# EAGLE board GPS Tracker v1.2 (EAGLE 6.4)
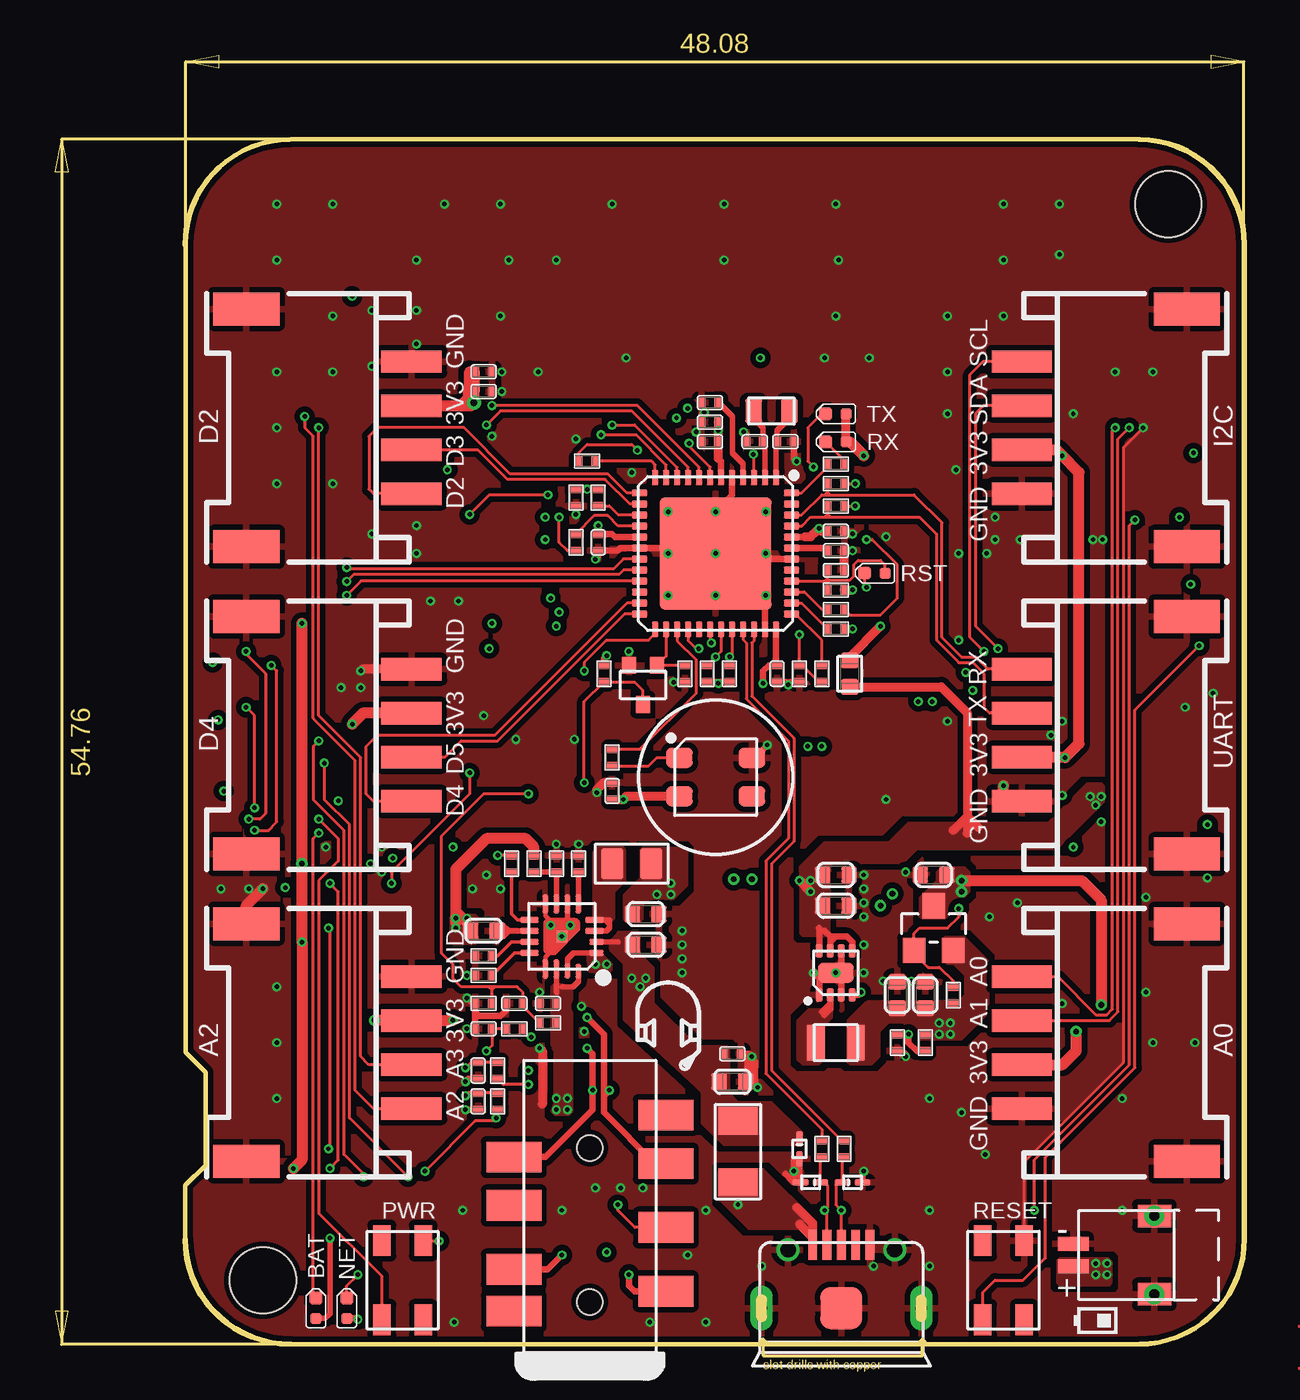
[diagram p2: board, top side]
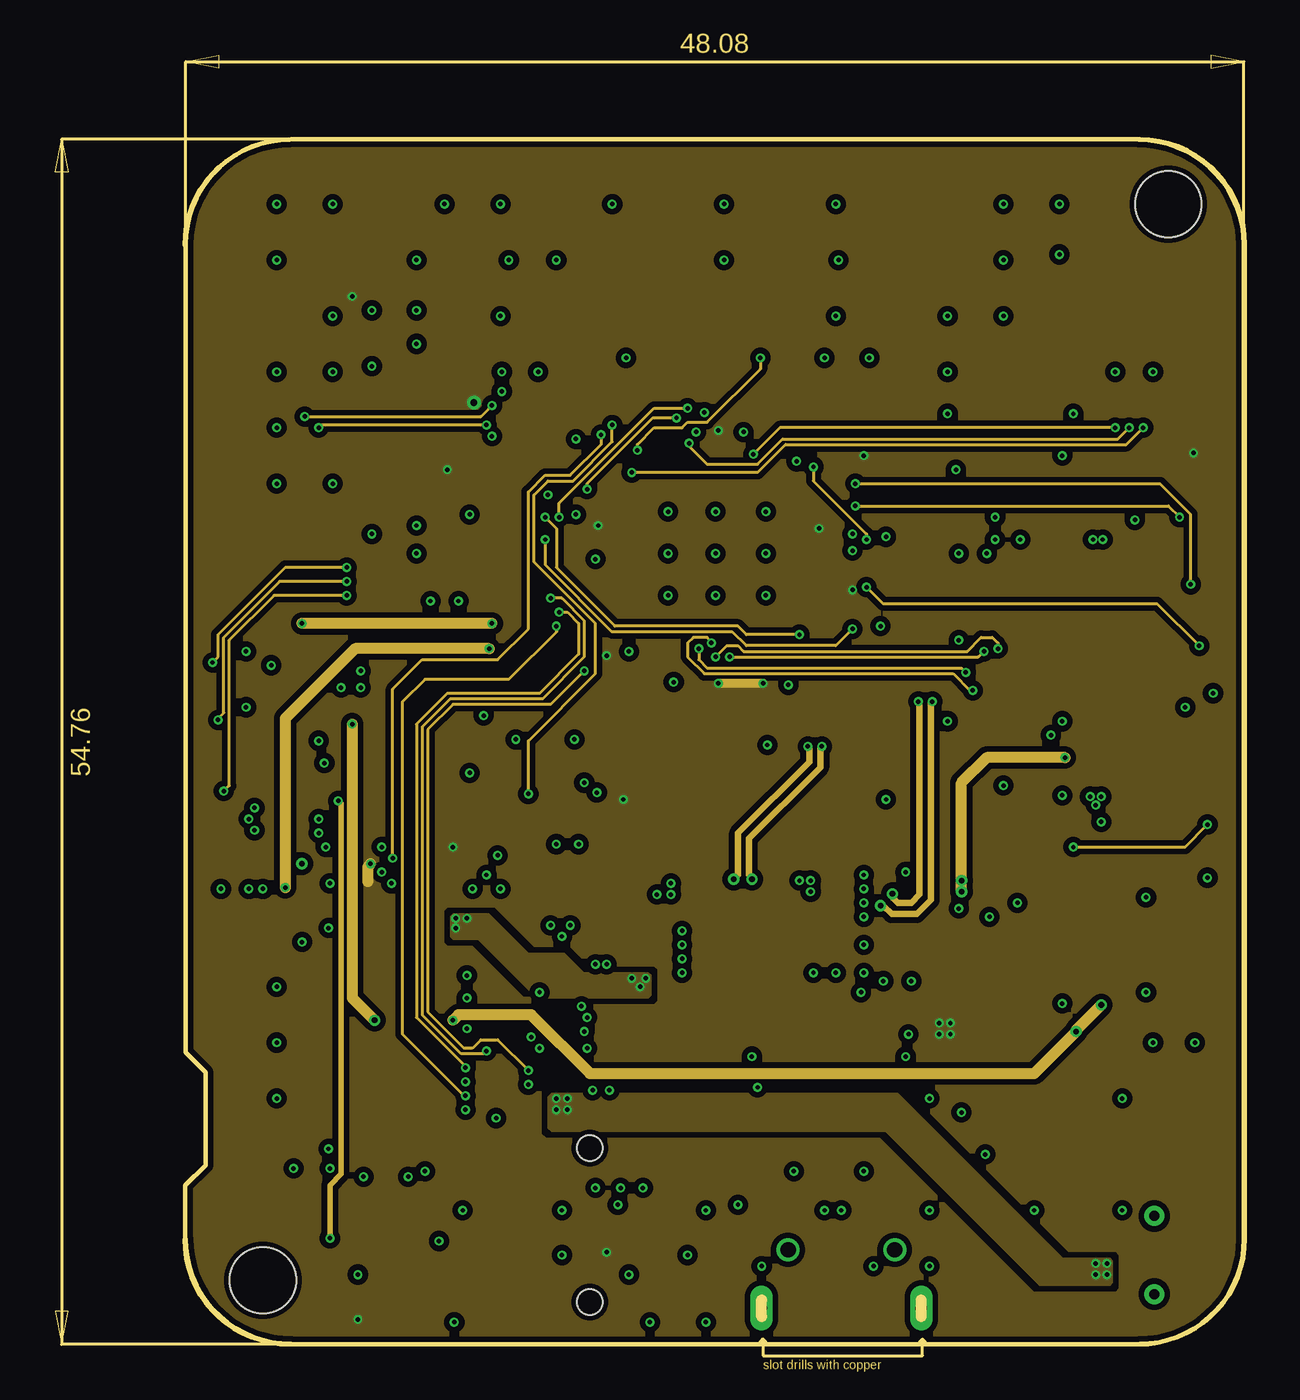
[diagram p3: board, inner layer PWR]
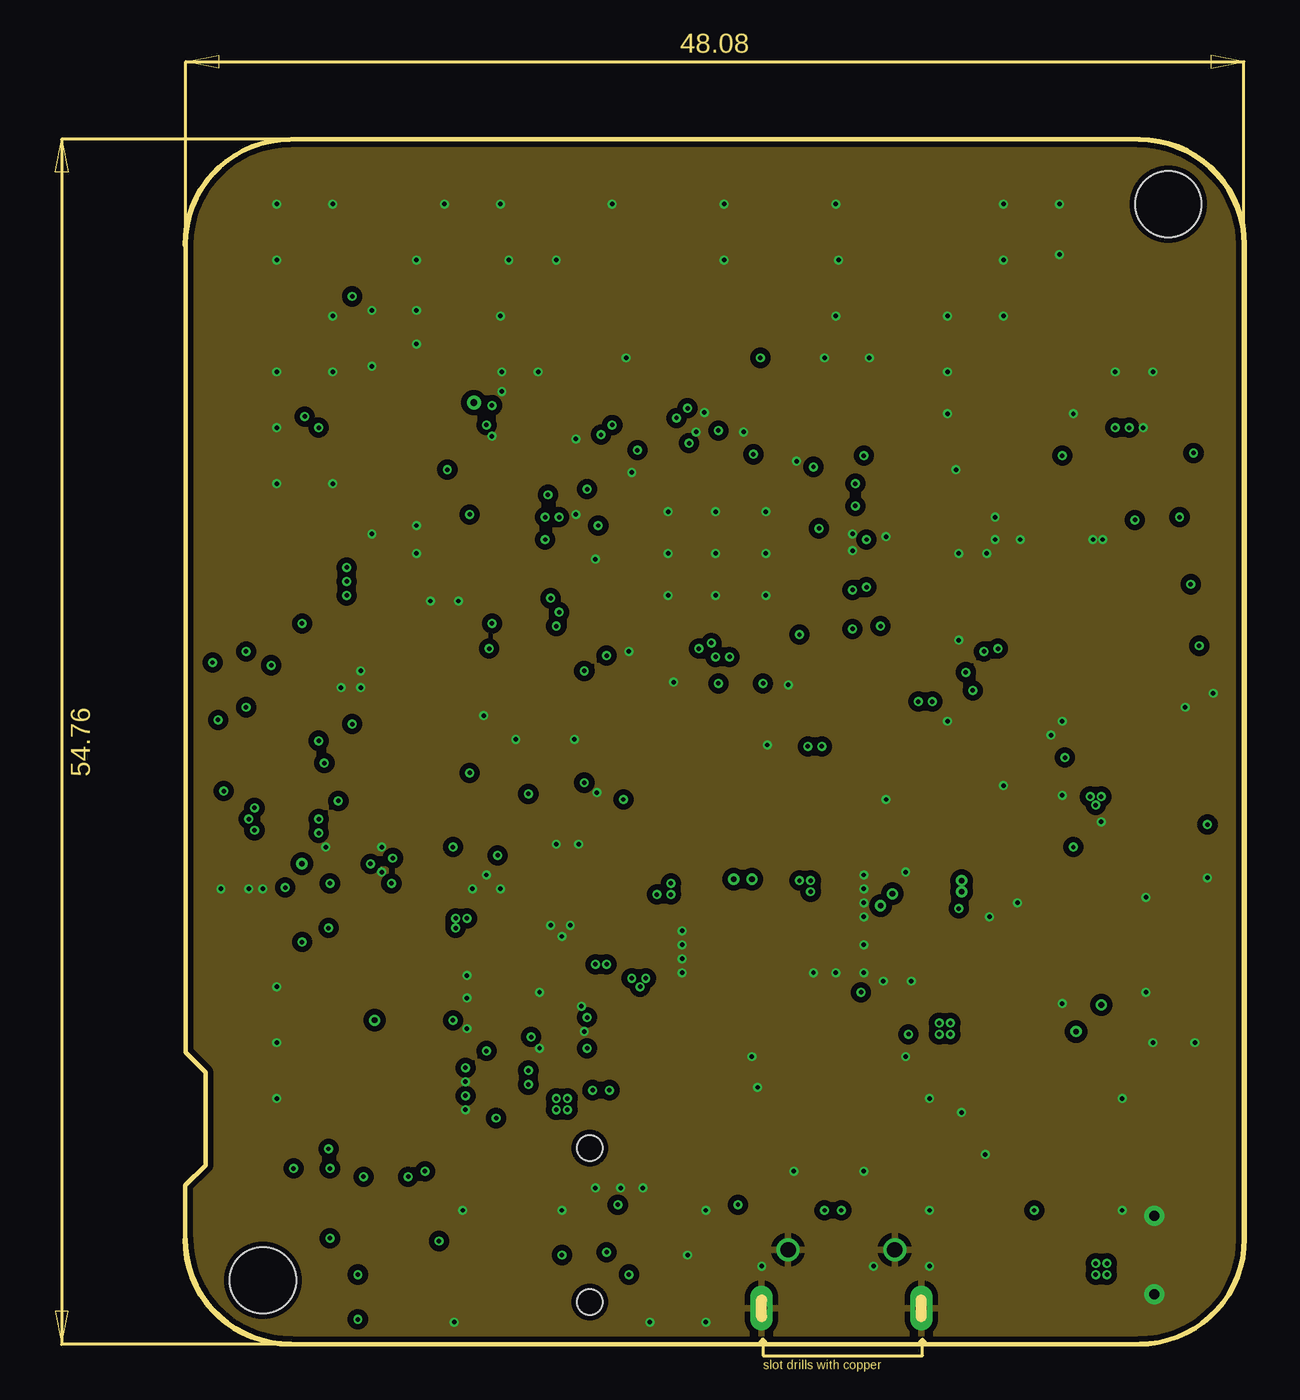
[diagram p4: board, inner layer GND]
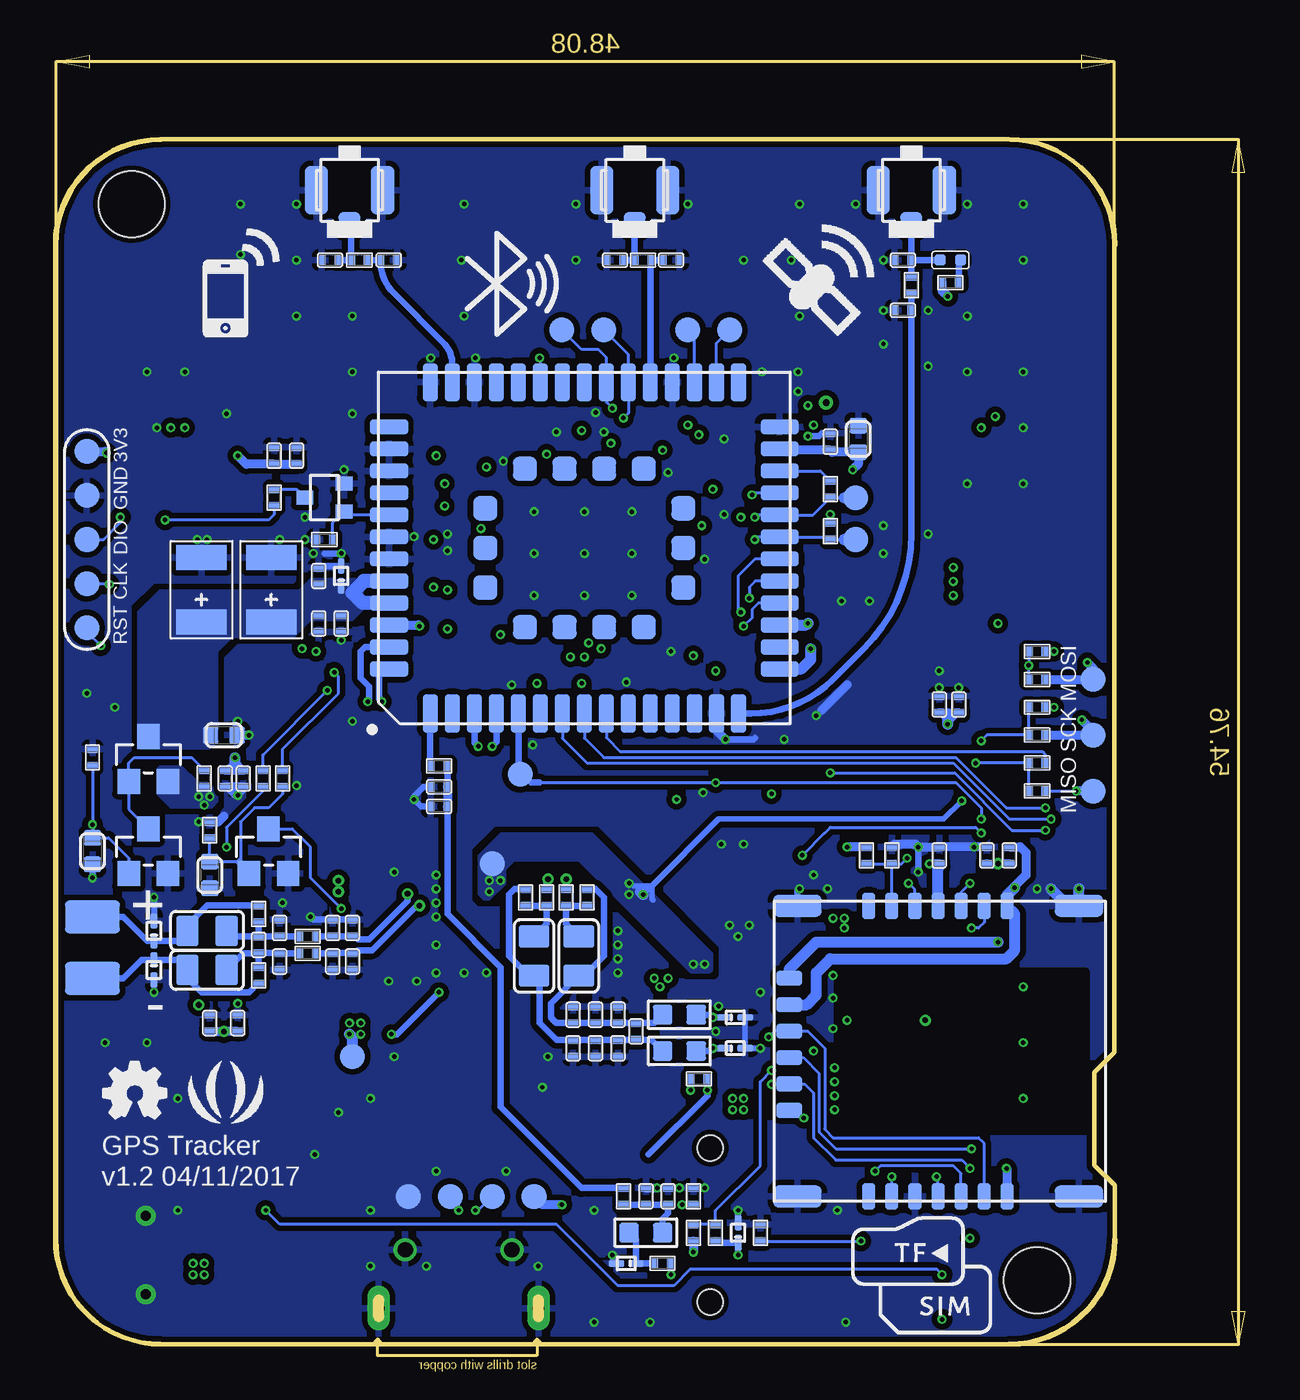
[diagram p5: board, bottom side, seen from below]

Size 48.18 x 54.76 mm. Coordinates in mm from the lower left corner, seen from the top.
Outline: 0.05,49.98 arc-90 4.83,54.76 43.4,54.76 arc-90 48.18,49.98 48.18,4.8 arc-90 43.4,0.03
Outline: 0.05,4.8 arc90 4.83,0.03
Outline: 4.83,0 43.43,0
Outline: 0,4.78 arc90 4.78,0 43.35,0 arc90 48.13,4.78 48.13,49.96 arc90 43.35,54.74
Outline: 4.78,54.74 arc90 0,49.96
Outline: 48.16,49.91 48.16,4.73
Outline: 0.05,50.11 0.05,13.31
Outline: 0.05,13.42 0.05,13.27 0.95,12.37 0.95,8.15 0.03,7.23 0.03,4.62
Copper layers (1*2*15*16): Top 0.035mm / dielectric 0.2mm / PWR 0.0175mm / dielectric 0.3mm / GND 0.0175mm / dielectric 0.2mm / Bottom 0.035mm
Design rules "SeeedStudio_4layer_DRU_no_angle_20140221 *": minimum track width 1mil, minimum drill 8mil, track to track 5mil, track to pad 5mil, pad to pad 5mil, via to via 5mil, smd to smd 0mil, copper to edge 10mil, drill to drill 8mil, minimum pad ring 4mil, minimum via ring 4mil, stop-mask expansion 4mil, vias tented up to drill 25mil, thermal gap 10mil
Holes 3 mm at 3.56,2.92 44.7,51.82
tRestrict: area 29.3,12.8 to 29.8,14.4

## Footprints (pad centres in the part's own frame; a part is rotated, then mirrored left to right if it is on the bottom)
HW4-SMD-2.0-90D = smd 1.01 x 2.74: 1 -3,-0.1; 2 -1,-0.1; 3 1,-0.1; 4 3,-0.1 | smd 1.5 x 3: SS1 -5.4,7.4; SS2 5.4,7.4
U-FL3P-SMD-2.6X2.6X1.0MM = smd 1.05 x 1: D -1.524,0 | smd 2.2 x 1.05: GND1 0,1.5; GND2 0,-1.5
C0402 = smd 0.508 x 0.385: 1 0,0.383; 2 0,-0.383
AVX-B = smd 1.143 x 2.286: + -1.46,0; - 1.46,0
C0603 = smd 0.762 x 0.696: 1 0,0.602; 2 0,-0.602
C0805 = smd 1.397 x 1.016: 1 0,0.889; 2 0,-0.889
SOD-923 = smd 0.7 x 0.3: 1 -0.45,0; 2 0.45,0
LED-0402 = smd 0.5 x 0.5: + -0.463,0 | smd 0.58 x 0.58: - 0.468,0
F1206 = smd 1.27 x 1.778: 1 -1.397,0; 2 1.397,0
8P-3.5-SMD = smd 1.4 x 2.5: 1 2.8,-3.45; 2 5.7,-3.45; 3 8.6,-3.45; 4 8.9,3.45; 5 1.9,3.45; 6 3.8,3.45; 7 6.7,3.45; 8 10.8,-3.45 | hole 1.149: 2.3,0; 9.3,0
HW2-SMD-1.0-90D = smd 1.524 x 1.016: 3 -3.429,1.778; 4 -3.429,-1.778 | smd 1.397 x 0.635: + 0.254,0.508; - 0.254,-0.508
MICRO-USB5+5P-SMD-0.65-7.2X5.06MM = smd 0.4 x 1.35: 1 -1.3,2.875; 2 -0.65,2.875; 3 0,2.875; 4 0.65,2.875; 5 1.3,2.875 | smd 1.9 x 1.9: P1 0,0 | drill 0.508 pad 1.016 long: P3 -3.625,0; P4 3.625,0 | drill 0.7: P5 -2.425,2.65; P6 2.425,2.65
H5-SMD-2.0-TEST = smd 1.143 x 1.143: 1 0,4; 2 0,2; 3 0,0; 4 0,-2; 5 0,-4
SIM+TF-24P-SMD-1.2-15.05X13.66X2.5MM = smd 1.2 x 0.6: P1 0,3.26; P2 0,4.31; P3 0,5.36; P5 13.2,3.26; P6 13.2,4.31; P7 13.2,5.36; T1 13.2,9.56; T2 13.2,8.51; T3 13.2,7.46; T4 13.2,6.41; T5 0,6.41; T6 0,7.46; T7 0,8.51; T8 0,9.56 | smd 0.7 x 1.2: P1B 9.91,13.17; P2B 7.51,13.17; P3B 3.91,13.17; P5B 8.71,13.17; P6B 6.31,13.17; P7B 5.11,13.17 | smd 1 x 2.2: PAD 0,0; PAD1 0,12.8; PAD2 13.2,0; PAD3 13.2,12.8
SW4P-SMD-4.5X3.2X2.5MM = smd 1.4 x 0.8: 1 -1.8,-0.94; 2 1.8,-0.94; 3 1.8,0.94; 4 -1.8,0.94
L0402 = smd 0.5 x 0.5: 1 -0.463,0; 2 0.463,0
L201610 = smd 0.8 x 1.6: 1 -0.9,0; 2 0.9,0
L0805 = smd 1.016 x 1.397: 1 -0.889,0; 2 0.889,0
L0603 = smd 0.889 x 0.889: 1 -0.762,0; 2 0.762,0
LED4-1.75-3.7X3.5X0.95MM = smd 1.2 x 0.9: 1 -1.65,0.875; 2 -1.65,-0.875; 3 1.65,-0.875; 4 1.65,0.875
SOT-323 = smd 0.635 x 0.762: 1 -0.635,-0.889; 2 0.635,-0.889; 3 0,0.889
SOT-23 = smd 1.016 x 1.143: 1 -0.889,-1.016; 2 0.889,-1.016; 3 0,1.016
R0402 = smd 0.508 x 0.385: 1 0,0.383; 2 0,-0.383
R0603 = smd 0.762 x 0.696: 1 0,0.602; 2 0,-0.602
2P-SMD-SPEAKER = smd 2.5 x 1.5: 1 0,1.397; 2 0,-1.397
TP-D45MIL = smd 1.143 x 1.143: T 0,0
MODULE68P-SMD-1.0-18.7X16X2.1MM = smd 1.75 x 0.7: 1 -7.525,7; 2 -7.525,6; 3 -7.525,5; 4 -7.525,4; 5 -7.525,3; 6 -7.525,2; 7 -7.525,1; 8 -7.525,0; 9 -7.525,-1; 10 -7.525,-2; 11 -7.525,-3; 12 -7.525,-4; 13 -7.525,-5; 14 -7.525,-6; 15 -7.525,-7; 28 7.525,-7; 29 7.525,-6; 30 7.525,-5; 31 7.525,-4; 32 7.525,-3; 33 7.525,-2; 34 7.525,-1; 35 7.525,0; 36 7.525,1; 37 7.525,2; 38 7.525,3; 39 7.525,4; 40 7.525,5; 41 7.525,6; 42 7.525,7 | smd 0.7 x 1.75: 16 -5.5,-8.875; 17 -4.5,-8.875; 18 -3.5,-8.875; 19 -2.5,-8.875; 20 -1.5,-8.875; 21 -0.5,-8.875; 22 0.5,-8.875; 23 1.5,-8.875; 24 2.5,-8.875; 25 3.5,-8.875; 26 4.5,-8.875; 27 5.5,-8.875; 43 5.5,8.875; 44 4.5,8.875; 45 3.5,8.875; 46 2.5,8.875; 47 1.5,8.875; 48 0.5,8.875; 49 -0.5,8.875; 50 -1.5,8.875; 51 -2.5,8.875; 52 -3.5,8.875; 53 -4.5,8.875; 54 -5.5,8.875 | smd 1.1 x 1.1: 55 -3.6,2.7; 56 -3.6,0.9; 57 -3.6,-0.9; 58 -3.6,-2.7; 59 -1.8,-4.5; 60 0,-4.5; 61 1.8,-4.5; 62 3.6,-2.7; 63 3.6,-0.9; 64 3.6,0.9; 65 3.6,2.7; 66 1.8,4.5; 67 0,4.5; 68 -1.8,4.5
DFN8G-0.5-2X2MM = smd 0.6 x 0.3: 1 -1,0.75; 2 -1,0.25; 3 -1,-0.25; 4 -1,-0.75; 5 1,-0.75; 6 1,-0.25; 7 1,0.25; 8 1,0.75 | smd 0.9 x 1.6: 9 0,0
QFN48-7X7 = smd 0.7 x 0.3: 1 -3.45,2.75; 2 -3.45,2.25; 3 -3.45,1.75; 4 -3.45,1.25; 5 -3.45,0.75; 6 -3.45,0.25; 7 -3.45,-0.25; 8 -3.45,-0.75; 9 -3.45,-1.25; 10 -3.45,-1.75; 11 -3.45,-2.25; 12 -3.45,-2.75; 25 3.45,-2.75; 26 3.45,-2.25; 27 3.45,-1.75; 28 3.45,-1.25; 29 3.45,-0.75; 30 3.45,-0.25; 31 3.45,0.25; 32 3.45,0.75; 33 3.45,1.25; 34 3.45,1.75; 35 3.45,2.25; 36 3.45,2.75 | smd 0.3 x 0.7: 13 -2.75,-3.45; 14 -2.25,-3.45; 15 -1.75,-3.45; 16 -1.25,-3.45; 17 -0.75,-3.45; 18 -0.25,-3.45; 19 0.25,-3.45; 20 0.75,-3.45; 21 1.25,-3.45; 22 1.75,-3.45; 23 2.25,-3.45; 24 2.75,-3.45; 37 2.75,3.45; 38 2.25,3.45; 39 1.75,3.45; 40 1.25,3.45; 41 0.75,3.45; 42 0.25,3.45; 43 -0.25,3.45; 44 -0.75,3.45; 45 -1.25,3.45; 46 -1.75,3.45; 47 -2.25,3.45; 48 -2.75,3.45 | smd 5.1 x 5.1: PAD 0,0
QFN16G-0.5-3X3MM@1 = smd 0.65 x 0.28: 1 -1.575,0.75; 2 -1.575,0.25 | smd 0.85 x 0.28: 3 -1.475,-0.25; 4 -1.475,-0.75; 9 1.475,-0.75; 10 1.475,-0.25; 11 1.475,0.25; 12 1.475,0.75 | smd 0.28 x 0.85: 5 -0.75,-1.475; 6 -0.25,-1.475; 7 0.25,-1.475; 8 0.75,-1.475; 13 0.75,1.475; 14 0.25,1.475 | smd 0.28 x 0.65: 15 -0.25,1.575; 16 -0.75,1.575 | smd 0.508 x 0.508: PAD 0,0
X2-SMD-L2.0X1.2X0.55MM = smd 0.762 x 1.143: 1 -0.813,0; 2 0.813,0

## Placement (x,y rotation side)
A0  [HW4-SMD-2.0-90D]  38.15,13.72 270 top
A2  [HW4-SMD-2.0-90D]  10.21,13.72 90 top
ANT1  IPEX  [U-FL3P-SMD-2.6X2.6X1.0MM]  34.8,52.45 90 bottom
ANT2  IPEX  [U-FL3P-SMD-2.6X2.6X1.0MM]  21.84,52.45 90 bottom
ANT4  IPEX  [U-FL3P-SMD-2.6X2.6X1.0MM]  9.27,52.45 90 bottom
C1  100nF  [C0402]  29.59,35.18 90 top
C2  100nF  [C0402]  29.59,36.07 90 top
C3  220uF  [AVX-B]  38.35,34.29 90 bottom
C4  10uF  [C0603]  40.51,27.69 90 bottom
C5  33pF  [C0402]  13.33,11.05 180 top
C6  33pF  [C0402]  13.33,12.45 180 top
C7  100nF  [C0402]  26.92,30.48 0 top
C8  100nF  [C0402]  18.8,36.45 180 top
C9  DNP  [C0402]  20.19,49.28 270 bottom
C10  10uF  [C0603]  33.65,15.88 0 top
C11  100nF  [C0402]  4.83,22.22 0 bottom
C12  100nF  [C0402]  8,22.22 180 bottom
C13  33pF  [C0402]  13.59,14.35 90 top
C14  100nF  [C0603]  46.48,22.42 0 bottom
C15  10uF  [C0603]  29.59,19.94 270 top
C16  10uF  [C0603]  32.38,15.88 0 top
C17  10uF  [C0603]  24.89,11.94 90 top
C18  1uF  [C0402]  23.88,41.91 90 top
C19  100nF  [C0402]  23.88,42.8 90 top
C20  100nF  [C0402]  29.59,36.96 90 top
C21  100nF  [C0402]  23.88,41.02 90 top
C22  10uF  [C0603]  20.95,18.16 90 top
C23  10uF  [C0603]  13.59,18.8 90 top
C24  10uF  [C0603]  20.95,19.56 90 top
C25  1uF  [C0402]  16.51,15.49 270 top
C26  100nF  [C0402]  24.89,13.21 90 top
C27  DNP  [C0402]  9.65,49.28 90 bottom
C28  10uF  [C0603]  29.59,21.34 270 top
C29  10uF  [C0603]  34.04,21.34 270 top
C30  100nF  [C0402]  39.88,14.61 0 bottom
C31  1uF  [C0402]  41.15,14.61 0 bottom
C32  100nF  [C0402]  7.11,29.08 0 bottom
C33  DNP  [C0402]  9.65,46.99 90 bottom
C34  DNP  [C0402]  22.73,49.28 90 bottom
C35  DNP  [C0402]  33.02,49.28 270 bottom
C36  DNP  [C0402]  35.69,49.28 90 bottom
C37  DNP  [C0402]  21.78,14.22 180 bottom
C38  1uF  [C0402]  13.59,44.2 270 top
C39  100nF  [C0402]  13.59,43.31 270 top
C40  220uF  [AVX-B]  41.53,34.29 90 bottom
C45  22pF  [C0402]  25.91,41.02 90 top
C46  22pF  [C0402]  27.3,41.02 270 top
C48  100pF  [C0402]  38.93,18.16 180 bottom
C49  33pF  [C0402]  34.67,17.4 180 bottom
C50  33pF  [C0402]  34.67,18.92 0 bottom
C51  33pF  [C0402]  37.97,17.4 180 bottom
C52  33pF  [C0402]  37.97,18.92 0 bottom
C53  22uF  [C0805]  41.27,17.02 270 bottom
C54  22uF  [C0805]  41.27,18.8 270 bottom
C56  10pF  [C0402]  35.56,18.92 0 bottom
C57  10pF  [C0402]  35.56,17.4 180 bottom
C58  33pF  [C0402]  24.64,14.99 0 bottom
C59  10pF  [C0402]  23.62,13.46 0 bottom
C60  33pF  [C0402]  24.64,13.46 180 bottom
C61  10pF  [C0402]  23.62,14.99 0 bottom
C62  33pF  [C0402]  30.73,24.45 90 bottom
C64  22uF  [C0805]  26.42,17.65 0 bottom
C65  22uF  [C0805]  24.38,17.65 0 bottom
C66  10pF  [C0402]  21.34,6.73 0 bottom
C67  10pF  [C0402]  30.73,25.34 90 bottom
C68  1uF  [C0402]  8,29.08 0 bottom
C69  33pF  [C0402]  20.32,6.73 0 bottom
C70  100nF  [C0402]  38.23,40.39 0 bottom
C71  1uF  [C0402]  37.21,40.39 0 bottom
C73  DNP  [C0402]  22.61,13.46 0 bottom
C74  DNP  [C0402]  22.61,14.99 0 bottom
C75  100nF  [C0402]  39.62,25.72 180 bottom
C76  1uF  [C0402]  40.45,25.72 180 bottom
C77  1uF  [C0402]  19.43,25.15 0 top
C78  100nF  [C0402]  14.99,15.49 270 top
C80  100nF  [C0402]  36.2,32.77 180 bottom
C81  10pF  [C0402]  36.2,34.92 0 bottom
C82  33pF  [C0402]  35.18,32.77 180 bottom
C83  100nF  [C0402]  12.95,41.02 0 bottom
C84  10uF  [C0603]  11.68,41.15 0 bottom
C85  100nF  [C0603]  41.15,21.34 0 bottom
C86  33pF  [C0402]  5.84,22.22 0 bottom
D1  DF2S6.8FS  [SOD-923]  27.94,8.89 270 top
D2  [HW4-SMD-2.0-90D]  10.21,41.66 90 top
D3  GREEN  [LED-0402]  29.59,42.29 180 top
D4  [HW4-SMD-2.0-90D]  10.21,27.69 90 top
D5  RED  [LED-0402]  7.37,1.65 90 top
D6  ESD;DF2S6.8FS  [SOD-923]  22.22,3.68 180 bottom
D7  ESD;DF2S6.8FS  [SOD-923]  43.69,18.8 90 bottom
D8  DF2S6.8FS  [SOD-923]  28.45,7.37 180 top
D9  DF2S6.8FS  [SOD-923]  30.35,7.37 0 top
D10  ESD;DF2S6.8FS  [SOD-923]  17.14,5.08 90 bottom
D11  ESD;DF2S6.8FS  [SOD-923]  17.27,13.46 0 bottom
D12  ESD;DF2S6.8FS  [SOD-923]  17.27,14.86 0 bottom
D13  DNP  [SOD-923]  35.18,34.92 90 bottom
D14  RED  [LED-0402]  31.37,35.05 180 top
D16  GREEN  [LED-0402]  5.97,1.65 90 top
D17  YELLOW  [LED-0402]  29.59,41.02 180 top
D21  ESD;DF2S6.8FS  [SOD-923]  43.69,17.02 270 bottom
F1  500mA  [F1206]  25.15,8.76 90 top
FR1  SEEEDSTUDIO-OPEN-SCH-FRAME  [SEEEDSTUDIO-PCB-FRAME]  51.94,16.64 0 top  (outside the outline)
FR2  SEEEDSTUDIO-OPEN-SCH-FRAME  [SEEEDSTUDIO-PCB-FRAME]  51.44,10.03 0 top  (outside the outline)
FR3  SEEEDSTUDIO-OPEN-SCH-FRAME  [SEEEDSTUDIO-PCB-FRAME]  51.18,3.05 0 top
FR4  SEEEDSTUDIO-OPEN-SCH-FRAME  [SEEEDSTUDIO-PCB-FRAME]  50.55,-4.19 0 top  (outside the outline)
I2C  [HW4-SMD-2.0-90D]  38.15,41.66 270 top
J1  8P-3.5mm-SMD  [8P-3.5-SMD]  18.41,-0.38 90 top
J2  JST-2P-SMD-90D  [HW2-SMD-1.0-90D]  40.64,4.06 180 top
J9  MICRO-USB5+4P  [MICRO-USB5+5P-SMD-0.65-7.2X5.06MM]  29.84,1.65 0 top
J10  DNP  [H5-SMD-2.0-TEST]  46.74,36.58 0 bottom
J11  [SIM+TF-24P-SMD-1.2-15.05X13.66X2.5MM]  1.65,6.73 90 bottom
K1  button 311020045  [SW4P-SMD-4.5X3.2X2.5MM]  9.91,2.92 90 top
K2  button 311020045  [SW4P-SMD-4.5X3.2X2.5MM]  37.21,2.92 90 top
L1  47nH  [L0402]  7.49,49.28 180 bottom
L2  0.33uH  [L201610]  29.59,13.72 0 top
L3  2.2uH  [L0805]  20.32,21.84 0 top
L5  BLM18BD252SN1  [L0603]  21.34,5.08 180 bottom
L11  BLM18BD252SN1  [L0603]  19.81,13.34 0 bottom
L12  DNP  [L0603]  19.81,14.99 0 bottom
LED1  [LED4-1.75-3.7X3.5X0.95MM]  24.13,25.78 180 top
Q1  305030011  [SOT-323]  35.94,38.48 90 bottom
Q2  305030011  [SOT-323]  20.83,29.97 180 top
Q3  2N7002  [SOT-23]  38.48,22.42 0 bottom
Q5  CJ3407A  [SOT-23]  34.04,18.92 0 top
Q6  CJ3407A  [SOT-23]  43.94,26.61 0 bottom
Q7  2N7002  [SOT-23]  43.94,22.42 0 bottom
R1  1k  [R0402]  16.13,5.08 0 bottom
R2  DNP  [R0402]  18.29,40.13 90 top
R3  10R  [R0402]  7.49,48.26 270 bottom
R4  0R  [R0402]  18.92,12.07 90 bottom
R5  0R  [R0402]  29.59,38.1 270 top
R6  0R  [R0402]  29.59,39.12 270 top
R7  DNP  [R0402]  26.8,20.32 180 bottom
R8  0R  [R0402]  17.78,36.45 180 top
R9  100k  [R0402]  19.05,30.48 180 top
R10  1k  [R0402]  10.16,22.22 180 bottom
R11  22R  [R0402]  29.97,8.89 180 top
R12  10k  [R0402]  29.59,34.29 270 top
R13  4.7k  [R0402]  24.77,30.48 0 top
R14  4.7k  [R0402]  23.75,30.48 0 top
R15  0R  [R0402]  17.91,21.84 180 top
R16  DNP  [R0402]  15.88,21.84 0 top
R17  2K  [R0402]  14.86,21.84 0 top
R18  0R  [R0402]  16.89,21.84 180 top
R19  2K  [R0402]  13.59,16.76 270 top
R20  2K  [R0402]  13.59,17.65 270 top
R21  22R  [R0402]  28.96,8.89 180 top
R22  0R  [R0402]  21.46,49.28 270 bottom
R23  470R  [R0402]  38.23,38.48 0 bottom
R24  1k  [R0402]  38.73,25.72 180 bottom
R25  0R  [R0402]  19.43,26.67 180 top
R26  470k  [R0402]  41.4,25.72 0 bottom
R27  DNP  [R0402]  29.59,32.51 270 top
R28  0R  [R0402]  9.27,48.13 0 bottom
R29  0R  [R0402]  34.35,49.28 270 bottom
R30  68R  [R0402]  36.7,17.78 270 bottom
R31  68R  [R0402]  36.7,18.54 270 bottom
R32  0R  [R0402]  20.57,3.68 270 bottom
R33  DNP  [R0402]  11.3,22.22 180 bottom
R34  10k  [R0402]  19.18,5.08 180 bottom
R35  0R  [R0402]  22.35,6.73 0 bottom
R36  470R  [R0402]  25.84,20.32 0 bottom
R37  470R  [R0402]  24.96,20.32 0 bottom
R38  1k  [R0402]  18.16,5.08 0 bottom
R39  0R  [R0402]  19.18,6.73 0 bottom
R40  100K_1%  [R0402]  33.65,13.72 180 top
R41  22K_1%  [R0402]  32.38,13.72 180 top
R42  1k  [R0402]  37.85,25.72 180 bottom
R43  470R  [R0402]  29.59,33.4 90 top
R44  470R  [R0402]  29.59,40 90 top
R45  10k  [R0402]  34.92,15.88 0 top
R46  10M  [R0402]  16.51,14.61 90 top
R47  10M  [R0402]  13.59,15.49 90 top
R48  0R  [R0402]  12.95,36.96 0 bottom
R49  0R  [R0402]  12.95,38.86 0 bottom
R50  10k  [R0402]  35.94,36.58 90 bottom
R51  1k  [R0402]  18.8,38.48 180 top
R52  5.6k  [R0402]  17.78,38.48 180 top
R53  DNP  [R0402]  28.96,30.48 0 top
R54  DNP  [R0402]  27.94,30.48 180 top
R55  10k  [R0402]  22.73,30.48 180 top
R56  22R  [R0402]  14.99,14.35 90 top
R57  22R  [R0402]  14.22,11.05 0 top
R58  22R  [R0402]  14.22,12.45 0 top
R59  1M  [R0402]  46.48,26.67 0 bottom
R60  1M  [R0402]  41.15,23.37 0 bottom
R61  0R  [R0603]  30.23,30.48 0 top
R62  DNP  [R0402]  3.56,31.5 90 bottom
R63  0R  [R0402]  3.56,30.23 90 bottom
R64  DNP  [R0402]  3.56,28.96 90 bottom
R65  0R  [R0402]  3.56,27.69 90 bottom
R66  DNP  [R0402]  3.56,26.42 90 bottom
R67  0R  [R0402]  3.56,25.15 90 bottom
R68  0R  [R0402]  30.73,26.29 90 bottom
R69  DNP  [R0402]  24,20.32 180 bottom
R70  DNP  [R0402]  38.93,16.76 0 bottom
R71  DNP  [R0402]  38.93,19.56 180 bottom
SPK  DNP  [2P-SMD-SPEAKER]  46.48,18.03 0 bottom
TP1  [TP-D45MIL]  26.42,6.73 270 bottom
TP2  [TP-D45MIL]  32.13,6.73 270 bottom
TP3  [TP-D45MIL]  28.32,6.73 270 bottom
TP4  [TP-D45MIL]  30.23,6.73 270 bottom
TP5  [TP-D45MIL]  27.05,25.91 90 bottom
TP6  [TP-D45MIL]  28.32,21.84 0 bottom
TP7  [TP-D45MIL]  19.43,46.1 90 bottom
TP8  [TP-D45MIL]  17.53,46.1 90 bottom
TP9  [TP-D45MIL]  11.81,36.58 0 bottom
TP10  [TP-D45MIL]  11.81,38.48 0 bottom
TP11  [TP-D45MIL]  25.15,46.1 90 bottom
TP12  [TP-D45MIL]  34.67,13.08 0 bottom
TP13  [TP-D45MIL]  23.24,46.1 90 bottom
TP14  [TP-D45MIL]  1.02,30.23 0 bottom
TP15  [TP-D45MIL]  1.02,27.69 0 bottom
TP16  [TP-D45MIL]  1.02,25.15 0 bottom
U1  [MODULE68P-SMD-1.0-18.7X16X2.1MM]  24.13,36.19 90 bottom
U3  ETA3410  [DFN8G-0.5-2X2MM]  29.59,16.89 90 top
U4  MCU-ATSAMD21-QFN48  [QFN48-7X7]  24.13,35.94 270 top
U5  ETA6003  [QFN16G-0.5-3X3MM@1]  17.14,18.54 180 top
U$10  [OSHW_FILLX100_NOTEXT]  45.97,10.29 0 bottom
U$14  [SEEED-SILK--TNAME-160*153MIL]  40.39,11.56 0 bottom
URAT  [HW4-SMD-2.0-90D]  38.15,27.69 270 top
X1  32.768KHz  [X2-SMD-L2.0X1.2X0.55MM]  26.67,42.42 180 top

## Tracks (layer width: path | path; a pad name or v marks a point on that pad's centre or on a via)
3V3  (via drill 0.2 pad 0.41, 0.3 pad 0.64)
  Top 0.305: U4.44 28.18,36.69 28.19,36.7 | v18.8,37.21 C8.2 19.43,36.83 19.57,36.69 U4.17 | U4.6 24.38,40.14 24.26,40.26 | D5.+ 7.83,1.19 v7.87,1.14 | U4.36 26.88,30.91 C7.1 26.54,30.86 26.29,30.61 v26.29,30.04 | R13.2 24.32,30.1 v24.26,30.04 24.2,30.1 R14.2 | R9.2 19.05,31.18 v19.18,31.31
  Top 0.406: 24.26,40.26 C21.2 v24.26,41.53 C18.2 | 28.19,36.7 28.45,36.7 28.7,36.96 | 28.7,36.96 v28.83,37.08 28.96,36.96 | C20.1 28.96,36.96 | 28.96,36.96 28.7,36.96 | C77.2 v19.94,24.76 20.08,24.91 LED1.4 | D3.+ 30.1,42.29 30.05,42.25 D17.+ | 12.95,43.31 C39.2 C38.2 | R12.1 v30.35,34.29
  Top 0.508: D2.3 12.3,42.66 12.56,42.66 | 12.56,42.66 13,42.66 v13.14,42.8 | 12.95,43.31 12.95,44.2 | D17.+ 30.23,41.02 v30.86,40.39 | 12.56,42.66 12.95,43.05
  Top 0.61: 12.95,43.31 12.95,43.05 12.95,42.99 v13.14,42.8
  PWR 0.406: v26.29,30.04 v24.26,30.04
  PWR 0.508: v8.44,21.84 8.32,21.72 8.32,21.02
  Bottom 0.406: 8,21.72 C12.1 v8.44,21.84 | R34.1 v19.18,4.19 | v11.94,39.75 11.68,40 C84.2 12.86,40.55 C83.2 15.2,40.64 U1.26 | R3.2 7.88,47.88 v7.62,47.62 | J10.1 45.91,40.58 v45.85,40.51 | R33.2 v12.19,22.61
  Bottom 0.508: J11.T4 8.06,21.66 8,21.72 | TP12.T 34.67,13.97 v34.8,14.1
  other vias: 34.29,14.61 34.8,14.61 34.29,14.1
  pour Top (isolate 0.254, no thermals): 33.4,13.84 35.33,13.84 36.58,15.09 36.58,17.4 35.43,18.54 34.54,18.54 34.42,18.42 34.42,17.4 34.54,17.27 34.92,17.27 35.43,16.76 35.43,15.88 35.18,15.62 30.99,15.62 30.1,14.73 30.1,12.83 30.23,12.7 31.24,12.7 31.62,13.08 31.62,14.22 32,14.61 32.64,14.61
  pour PWR (isolate 0.254, rank 6): -0.25,54.99 48.64,54.99 48.64,-0.25 1.65,-0.25 1.65,-0.89 -0.25,-0.89
3V3B  (via drill 0.2 pad 0.41, 0.25 pad 0.51)
  Top 0.508: URAT.3 39.99,26.69 v40,26.67 40.64,27.31 40.64,39.62 v39.88,40.39 39.61,40.66 I2C.3 | v35.31,21.08 40.77,21.08 41.66,20.19 v41.66,15.43 | A0.3 39.89,12.72 40.51,13.34 v40.51,14.22 | v8.64,14.73 8.65,14.72 A2.3 12.18,14.72 v12.19,14.73 | D4.3 8.11,28.69 v7.62,28.19
  PWR 0.508: v35.31,20.57 35.31,25.53 36.45,26.67 v40,26.67 | v41.66,15.43 40.51,14.29 v40.51,14.22 38.61,12.32 18.41,12.32 15.75,14.99 12.45,14.99 v12.19,14.73 | v8.64,14.73 7.62,15.75 v7.62,28.19
  Bottom 0.406: C31.2 v40.52,14.22 v40.51,14.22 C30.2 | C71.2 C70.2 39.49,40 v39.88,40.39 | 7.62,28.7 C68.2 7.87,28.7 7.62,28.45 | 7.62,28.7 C32.2 7.24,28.7 7.49,28.45 | 7.62,28.57 7.62,28.7 | C76.2 39.99,26.1 | 39.99,26.1 C75.2 | 39.99,26.1 39.99,26.34 40,26.35 | 39.75,26.16 40,26.42 40.26,26.16
  Bottom 0.508: v7.62,28.19 7.62,28.45 7.62,28.57 | 40,26.35 40,26.42 v40,26.67
  pour Top (isolate 0.254, no thermals): 34.42,21.72 35.43,21.72 35.69,21.46 35.69,20.57 35.43,20.32 35.13,20.32 34.67,19.86 34.67,19.43 34.54,19.3 33.53,19.3 33.4,19.43 33.4,20.32 34.16,21.08 34.16,21.46
5V0  (via drill 0.2 pad 0.41)
  Top 0.254: U5.2 19.68,18.29
  Top 0.406: R16.1 15.88,22.48
  Top 0.508: 15.88,22.48 15.88,22.61 15.49,22.99 13.72,22.99 12.32,21.59 12.32,19.68 | 12.32,19.68 12.83,19.18 | 12.32,19.68 12.32,19.18
  other vias: 20.32,16.64 20.95,16.64 12.32,19.37 12.32,18.92 20.7,16.26 12.83,19.37
  pour Top (isolate 0.254, no thermals): 19.3,18.42 19.68,18.8 20.57,18.8 20.7,18.67 20.7,17.78 21.34,17.14 21.34,16.51 21.08,16.26 20.19,16.26 19.94,16.51 19.94,17.27 19.3,17.91
  pour Top (isolate 0.254, no thermals): 13.21,18.16 12.19,18.16 12.06,18.29 12.06,19.43 12.19,19.56 13.21,19.56 13.33,19.43 13.33,18.29
  pour PWR (isolate 0.254, no thermals): 21.08,16.89 18.16,16.89 17.27,17.78 15.62,17.78 13.84,19.56 12.19,19.56 12.06,19.43 12.06,18.54 12.19,18.42 13.33,18.42 16,15.75 21.08,15.75 21.21,15.88 21.21,16.76
  pour Top (isolate 0.254, rank 2, no thermals): 28.07,9.02 24.51,9.02 23.49,10.03 23.49,11.43 23.24,11.68 19.94,14.73 19.94,16.76 20.07,16.89 21.21,16.89 21.34,16.76 21.34,15.53 23.27,13.59 24.64,13.59 24.77,13.46 24.77,11.43 25.15,11.05 26.67,11.05 28.07,9.65
!RESET  (via drill 0.2 pad 0.41)
  Top 0.127: K2.4 36.27,2.36 36.83,2.92 38.1,2.92 39.12,3.94 39.12,8.51 43.18,12.57 43.18,28.83 v46.1,31.75 | D14.- 30.9,34.5 v30.99,34.42
  PWR 0.127: v46.1,31.75 44.2,33.66 31.75,33.66 v30.99,34.42
  Bottom 0.127: J10.5 46.74,32.39 v46.1,31.75
A1_PB08_AIN2  (via drill 0.2 pad 0.41)
  Top 0.127: U4.7 23.88,39.87 22.92,40.83 v22.92,40.96 | v42.93,41.66 42.42,41.15 42.42,15.11 42.02,14.72 A0.2
  PWR 0.127: v42.93,41.66 42.42,41.15 27.18,41.15 26.03,40 23.75,40 22.92,40.83 v22.92,40.96
A2_PB09_AIN3  (via drill 0.2 pad 0.41)
  Top 0.127: A2.1 8.59,10.72 7.75,11.56 7.75,26.54 5.84,28.45 5.84,41.28 5.46,41.66 v5.46,42.16 | U4.8 23.38,39.87 20.57,42.67 v13.97,42.67
  PWR 0.127: v5.46,42.16 13.46,42.16 v13.97,42.67
A3_PA04_AIN4  (via drill 0.2 pad 0.41)
  Top 0.127: A2.2 8.37,12.72 8,13.08 8,26.67 6.1,28.57 v6.1,41.66 | U4.9 22.88,39.86 20.32,42.42 14.35,42.42 v13.72,41.78
  PWR 0.127: v13.72,41.78 6.22,41.78 v6.1,41.66
A4_PA05_AIN5  (via drill 0.2 pad 0.41)
  Top 0.127: R47.2 13.97,16.13 | 13.97,16.13 13.97,16.25 13.97,16.26 | R46.1 15.37,15.36 C78.1 15.37,16 15.11,16.26 14.1,16.26 | 14.1,16.26 13.97,16.26 | 13.97,16.26 13.84,16.26 | 13.97,16.13 13.84,16.26 | 13.97,16.13 | 13.97,16.13 14.1,16.26 | 13.84,16.26 12.57,16.26 12.19,16.64 12.19,17.27 11.68,17.78 11.68,23.11 13.59,25.02 v15.62,25.02 | U4.10 22.38,39.85 20.45,41.78 v19.43,41.78
  PWR 0.127: v19.43,41.78 19.43,41.02 17.65,39.24 16.51,39.24 15.88,38.61 15.88,35.56 18.67,32.77 18.67,30.48 15.62,27.43 v15.62,25.02
AO_PA02_AINO/DAC  (via drill 0.2 pad 0.41)
  Top 0.127: U4.3 25.88,40.41 v25.84,40.45 | v42.29,41.66 42.16,41.53 42.16,15.24 41.91,14.99 41.4,14.99 39.67,16.72 A0.1
  PWR 0.127: v42.29,41.66 27.05,41.66 v25.84,40.45
BT_ANT
  Bottom 0.305: U1.32 21.13,49.23 R22.1 C9.2
CLK  (via drill 0.2 pad 0.41)
  Top 0.127: v8.13,7.62 8.13,7.75 7.24,8.64 7.24,23.37 5.84,24.76 5.84,27.18 v6.1,27.43
  Bottom 0.127: J11.T5 8.06,7.55 v8.13,7.62 | R65.1 | R65.1 R64.1 | R65.1 5.84,27.69 v6.1,27.43
CMD/DI  (via drill 0.2 pad 0.41)
  Top 0.127: v3.17,23.37 3.81,23.37 4.19,23.75 4.19,30.61 v3.94,30.86 | v12.95,25.97 12.95,25.02 9.4,21.46 v9.4,20.96
  Bottom 0.127: v12.95,25.97 7.3,25.97 4.7,23.37 v3.17,23.37 | R63.1 v3.94,30.86 R62.1 | J11.T3 9.11,20.67 v9.4,20.96
D0/RX_PA11_TCC0-W3
  Top 0.127: U4.16 19.7,37.19 19.24,37.66 18.6,37.66 R8.2
D1/TX_PA10_TCC0-W2
  Top 0.127: U4.15 19.71,37.69 19.31,38.1 R51.1
D2_PA08_TCC0-W0
  Top 0.127: U4.13 20.11,38.69 19.24,39.56 14.8,39.56 12.7,41.66 8.76,41.66 8.38,41.28 8.38,38.86 8.59,38.66 D2.1
D3_PA09_TCC0-W1
  Top 0.127: U4.14 20.23,38.19 19.11,39.31 14.67,39.31 13.32,40.66 D2.2
D4_PA14_TCC0-W4
  Top 0.127: D4.1 8.59,24.69 8.25,25.02 8.25,27.18 8.76,27.69 14.1,27.69 20.1,33.69 U4.23
D5_PA15_TCC0-W5
  Top 0.127: U4.24 19.98,33.19 14.22,27.43 12.57,27.43 11.83,26.69 D4.2
D7_DGI_GPIO1  (via drill 0.2 pad 0.41)
  Top 0.127: U4.30 23.88,31.94 v23.94,31.88
  PWR 0.127: v23.94,31.88 23.94,31.94 23.75,32.13 23.11,32.13 22.86,31.88 22.86,31.24 23.62,30.48 34.92,30.48 35.69,29.72 v35.81,29.72
  Bottom 0.127: v35.81,29.72 38.73,26.8 R24.2
D8_DGI_GPIO2  (via drill 0.2 pad 0.41)
  Top 0.127: U4.11 21.88,39.97 20.51,41.34 v18.92,41.34
  PWR 0.127: v18.92,41.34 18.92,40.89 17.53,39.5 16.38,39.5 15.62,38.73 15.62,32.51 14.22,31.11 10.8,31.11 9.46,29.78 v9.46,22.1
  Bottom 0.127: J11.T2 R10.1 | R10.1 | R33.1 R10.1 | R10.1 9.72,21.84 v9.46,22.1
D9_DGI_GPIO3
  Top 0.127: U4.12 21.38,39.96 21.21,40.13 R2.2
D10_SS
  Top 0.127: U4.27 22.38,31.98 23.24,31.11 23.24,29.59 20.7,27.05 R25.2
D11_MOSI  (via drill 0.2 pad 0.41)
  Top 0.127: v18.16,30.61 18.16,30.99 19.18,32 21.08,32 21.38,32.3 U4.25
  PWR 0.127: v15.62,12.45 14.22,13.84 13.46,13.84 13.08,13.46 12.7,13.46 11.05,15.11 11.05,27.94 12.19,29.08 16.64,29.08 v18.16,30.61
  Bottom 0.127: R34.2 R38.1 18.16,6.1 16.13,8.13 16.13,11.94 v15.62,12.45
D12_MISO  (via drill 0.2 pad 0.41)
  Top 0.127: U4.28 22.88,31.98 23.24,31.62 v23.37,31.62
  PWR 0.127: v23.37,31.62 23.37,31.11 23.75,30.73 35.31,30.73 v35.5,30.54
  Bottom 0.127: v35.5,30.54 35.31,30.35 35.31,29.59 37.85,27.05 R42.2
D13_SCK
  Top 0.127: R55.2 Q2.1 21.88,31.28 U4.26
D-1  (via drill 0.2 pad 0.41)
  Top 0.127: R21.1 28.9,8.45 D8.1 29.08,7.37 29.21,7.24 29.21,6.22 v29.08,6.1 29.2,5.98 J9.2
  Bottom 0.127: v29.08,6.1 28.96,6.1 TP3.T
DAT0/DO  (via drill 0.2 pad 0.41)
  Top 0.127: v10.16,7.62 7.49,10.29 7.49,23.62 6.35,24.76 v6.35,26.42
  Bottom 0.127: J11.T7 v10.16,7.62 | R67.1 R66.1 v6.35,26.42
DBG_RXD
  Bottom 0.127: U1.30 19.13,45.8 TP7.T
DBG_TXD
  Bottom 0.127: U1.29 18.13,45.5 TP8.T
DTR  (via drill 0.2 pad 0.41)
  Top 0.127: v20.57,40.64 20.32,40.89 18.29,40.89 17.91,40.51 R2.1
  PWR 0.127: v20.57,40.64 20.57,40.89 21.34,41.66 22.61,41.66 22.86,41.91 23.75,41.91 26.16,44.32 v26.16,44.83
  Bottom 0.127: U1.37 26.13,44.8 v26.16,44.83
FM_N  (via drill 0.2 pad 0.41)
  Top 0.305: J1.3 21.37,8.22 19.05,10.54 19.05,11.3 | 19.05,11.3 v19.3,11.56 | 19.05,11.3 19.05,14.1 v18.29,14.86
  Bottom 0.305: D12.1 v18.29,14.86 18.41,14.99 L12.2 | R4.1 v19.31,11.56 v19.3,11.56
FM_P  (via drill 0.2 pad 0.41)
  Top 0.305: J1.4 16.39,8.52 18.54,10.67 v18.54,11.56 18.54,13.21 v18.29,13.46
  Bottom 0.305: R4.2 v18.54,11.56 18.54,11.3 21.21,8.64 | D11.1 v18.29,13.46 18.41,13.34 L11.2
GND  (via drill 0.2 pad 0.41, 0.46 pad 0.91)
  Top 0.127: K2.2 38.15,8.31 42.67,12.83 42.67,40.77 v43.56,41.66
  Top 0.203: U5.8 16.39,19.48 16.83,19.05 | U5.13 16.39,17.6 16.64,17.84
  Top 0.254: U5.10 14.74,18.79 | 14.73,18.79 C23.2 | 14.74,18.79 14.48,19.05 14.22,19.05 | 14.74,18.79 14.73,18.79 | 14.73,18.79 14.48,18.54 14.35,18.54 | U5.6 17.39,18.79 U5.PAD | R47.1 13.21,15.43 | C78.2 14.6,15.36
  Top 0.305: v18.67,35.69 18.8,35.81 C8.1 19.68,36.07 19.81,36.19 U4.18 21.72,36.19 v21.97,35.94 | C5.1 v12.77,10.67 v12.76,10.67 | C6.1 12.89,12.06 v12.76,11.94 | 16.83,19.05 v16.64,19.05 | C26.2 25.65,13.21 v25.78,13.08 | C17.2 25.65,11.94 25.78,11.94 25.92,11.8 | 25.92,11.8 v26.03,11.68 | D9.2 30.8,7.82 v30.86,7.87 | v27.69,7.87 28,7.56 D8.2 27.81,7.37 | U3.6 29.84,17.14 U3.9 29.84,16.64 U3.3 | LED1.2 25.89,26.66 v26.48,27.24 | U4.42 26.67,35.69 v26.42,35.94 | U4.35 26.38,34 v26.42,34.04 | U4.5 24.88,38.6 v24.13,37.85 | C18.1 23.49,42.23 v23.62,42.35 | C45.1 25.52,41.34 v25.4,41.47 | C46.1 27.69,40.26 v27.81,40.13 | U3.1 28.84,16.62 v28.57,16.89 | D1.2 27.94,7.75 | R54.1 27.56,30.1 v27.43,29.97 27.31,30.1 C7.2 | 27.81,7.37 27.69,7.49 27.69,8.38 | 27.81,7.37 27.69,7.37 27.3,7.75 | 25.92,11.8 25.92,12.87 25.83,12.95 | 14.6,15.36 14.6,15.17 14.35,14.92 13.4,14.92 13.21,15.11 | 13.21,15.43 13.21,15.11 | 13.21,15.11 C13.1 | C13.1 | C13.1 v12.83,14.35 | R47.1 13.08,15.49 v12.83,15.75
  Top 0.406: C77.1 19.05,25.53 18.73,25.21 v18.73,25.08 | D4.4 8.08,30.69 v8,30.61 | v16.13,13.46 16.26,13.34 16.26,10.92 | 25.65,11.94 25.65,12.95 v25.78,13.08 | R41.1 32.51,13.33 v32.77,13.08 | C1.2 C2.2 | v30.35,36.83 30.1,36.83 C20.2
  Top 0.508: URAT.4 37.54,24.69 37.21,25.02 v37.21,25.4 | A2.SS2 2.81,19.95 v3.56,20.7
  PWR 0.127: v43.56,41.66 42.8,40.89 27.3,40.89 26.03,39.62 v20.32,39.62
  Bottom 0.254: D12.2 D11.2 v16.13,13.46
  Bottom 0.305: D10.2 v17.14,6.1 | D6.2 22.67,3.75 22.86,3.94 v22.86,4.06 | J11.PAD3 14.45,20.6 v14.35,20.7 | v36.58,19.43 36.45,19.31 C56.1 C50.1 | C67.1 31.43,25.34 31.88,24.89 v31.88,24.76 31.56,24.45 C62.1 | C83.1 13.33,41.4 13.46,41.28 v13.97,41.28 | v17.72,27.5 16.45,27.5 16.38,27.56 | v8.95,22.61 v8.95,21.46 | D13.2 36.13,35.38 C81.1 | v35.18,35.94 35.94,35.94 | v43.69,20.32 D7.2 | C14.2 v46.48,21.21
  Bottom 0.406: U1.14 18.13,27.91 v17.72,27.5 | C66.1 v20.83,7.11 | v39.88,28.32 39.91,28.29 C4.2 v39.37,27.69 | 40.51,24 40.77,23.75 R60.1 v41.65,23.75 v41.66,23.75 | C86.1 C12.2 v8.95,22.61 9.08,22.73 10.03,22.73 R10.2 | 13.33,28.83 12.19,29.97 | C76.1 C75.1 39.62,25.27 39.88,25.02 | 39.88,25.02 40,25.02 40.26,25.27 | v39.88,24.96 39.88,25.02
  Bottom 0.508: v2.92,20.7 2.15,19.93 J11.PAD2 v1.65,20.7
  other vias: 17.91,22.73 16.89,22.73 31.75,16.51 33.02,16.51 30.86,16.89 29.59,16.89 30.86,20.07 30.86,20.7 12.83,16.76 16.13,16 18.03,15.37 30.86,21.34 17.78,37.72 17.78,41.15 30.35,36.07 13.59,28.57 24.13,35.94 18.67,7.11 19.81,7.11 13.08,20.7 13.72,21.34 17.14,18.54 17.53,19.05 22.61,16.89 22.61,17.53 22.61,18.8 22.61,18.16 37.85,20.07 32.77,21.46 36.45,35.94 31.88,36.7 35.18,32 36.83,36.58 37.97,36.58 36.83,37.59 35.05,39.75 34.67,42.29 40.39,42.29 31.11,44.83 29.08,44.83 23.24,41.47 10.54,46.99 10.54,49.28 20.07,44.83 34.67,28.32 22.22,30.1 20.19,31.5 21.97,37.85 26.42,37.85 24.13,34.04 21.97,34.04 30.86,18.16 35.31,10.54 10.54,37.21 10.54,35.94 11.18,33.78 12.45,33.78 46.74,29.59 15.05,27.5 18.16,14.22 6.41,22.61 8.51,46.99 8.51,44.45 8.51,36.83 6.73,39.12 6.73,44.2 6.73,51.82 11.81,51.82 42.29,44.2 45.47,28.96 45.91,13.72 10.54,45.47 43.69,16 39.88,15.49 44.07,5.84 44.07,2.29 37.21,46.74 34.67,44.2 16.89,49.28 14.35,46.74 14.35,51.82 4.19,51.82 4.19,49.28 6.73,46.74 4.19,44.2 4.19,39.12 4.19,41.66 4.19,16.26 4.19,13.72 4.19,11.18 33.85,11.18 44.01,13.72 33.85,3.56 31.31,3.56 26.23,3.56 23.69,1.02 21.15,1.02 12.26,1.02 12.64,6.1 23.69,6.1 33.85,6.1 36.39,8.64 42.61,11.18 42.61,6.1 44.01,44.2 16.07,44.2 30.86,19.43 14.41,44.2 14.41,43.31 19.43,51.82 24.51,51.82 29.59,51.82 39.75,51.82 29.59,46.74 29.72,49.28 24.51,49.28 14.73,49.28 37.21,49.28 39.75,49.53 37.21,51.82 34.67,46.74 7.11,29.85 8,29.85 41.27,36.58 41.72,36.58
  pour Top (isolate 0.254, rank 6): -0.25,54.99 48.64,54.99 48.64,-0.25 -0.25,-0.25
  pour GND (isolate 0.254, rank 6): -0.25,54.99 48.64,54.99 48.64,-0.25 1.65,-0.25 1.65,-1.52 -0.25,-1.52
  pour Bottom (isolate 0.254, rank 6): 1.65,-0.25 1.65,-2.16 -0.25,-2.16 -0.25,54.99 48.64,54.99 48.64,-0.25
GNSS_ANT
  Bottom 0.305: R28.2 C33.2 9.27,36.84 arc45 11.43,31.62 12.84,30.22 arc45 16.57,28.67 U1.15
GNSS_RXD  (via drill 0.2 pad 0.41)
  Top 0.127: R53.2 28.83,30.1 28.07,30.86 R54.2 v27.94,32.26
  PWR 0.127: v27.94,32.26 25.53,32.26 25.15,32.64 19.56,32.64 16.89,35.31 16.89,37.08 v16.38,37.59
  Bottom 0.127: v16.38,37.59 16.28,37.69 U1.23 13.74,37.69 R49.2 TP10.T
  Bottom 0.508: TP10.T 12.32,38.48
GNSS_TXD  (via drill 0.2 pad 0.41)
  Top 0.127: R27.1 v30.35,32.51
  PWR 0.127: v30.35,32.51 29.59,31.75 25.53,31.75 24.89,32.39 19.43,32.39 16.38,35.43 v16.38,36.58
  Bottom 0.127: v16.38,36.58 16.26,36.69 U1.22 13.08,36.69 R48.2 TP9.T
  Bottom 0.508: TP9.T 12.32,36.57 12.32,36.58
LOUDSPKN  (via drill 0.2 pad 0.41, 0.25 pad 0.51)
  PWR 0.305: v31.62,19.94 31.75,19.94 32.13,19.56 33.27,19.56 33.91,20.19 33.91,29.15 v33.97,29.21
  Bottom 0.305: U1.53 34.09,31.69 34.29,31.5 34.29,30.29 33.91,29.91 33.91,29.27 v33.97,29.21 | R30.1 C57.2 C49.2 34.54,17.78 34.42,17.91 33.78,17.91 31.75,19.94 v31.62,19.94
LOUDSPKP  (via drill 0.2 pad 0.41, 0.25 pad 0.51)
  PWR 0.305: v32.16,20.48 32.16,20.32 32.42,20.07 33.02,20.07 33.4,20.45 33.4,29.15 v33.34,29.21
  Bottom 0.305: U1.54 33.02,30.68 33.14,30.68 33.46,30.35 33.46,29.34 v33.34,29.21 | R31.1 C56.2 C50.2 34.54,18.54 34.42,18.42 33.91,18.42 32.16,20.16 v32.16,20.48
MICP
  Bottom 0.305: 31.13,28.05 31.13,26.3 R68.1
  Bottom 0.406: U1.1 31.13,28.05
N$1
  Bottom 0.127: Q7.3 44.83,24.32 Q6.1 44.83,26.42 44.58,26.67 41.97,26.67 R26.1
N$2
  Top 0.127: R25.1 21.08,26.29 21.45,26.66 LED1.3
N$3  (via drill 0.2 pad 0.41)
  Top 0.127: v11.56,4.7 10.87,4.7 K1.2
  Bottom 0.127: R1.2 v11.56,4.7
N$4
  Bottom 0.305: R3.1 7.11,49.2 L1.1
N$5
  Top 0.254: U4.4 25.38,40.03 24.89,40.51 24.89,42.16 C19.2
  Top 0.305: C19.2
N$6  (via drill 0.2 pad 0.41)
  Top 0.305: J1.1 20.44,2.42 20.19,2.67 v20.19,3.18
  Bottom 0.305: R32.1 v20.19,3.18
N$7  (via drill 0.2 pad 0.41)
  PWR 0.127: v40.39,22.61 45.47,22.61 v46.48,23.62
  Bottom 0.127: v40.39,22.61 40.39,23.5 38.73,25.15 R24.1 | Q7.1 44.83,22.1 45.75,23.02 C14.1 v46.48,23.62 R59.2
N$8
  Top 0.254: U4.1 26.88,40.98 C46.2 26.92,41.53 27.48,42.09 X1.1
N$9
  Bottom 0.152: ANT2.D
  Bottom 0.305: ANT2.D R22.2 C34.2
N$10  (via drill 0.2 pad 0.41)
  Top 0.406: R61.1 30.23,31.24 v31.62,32.64
  Bottom 0.406: U1.52 31.68,32.69 v31.62,32.64
N$11
  Top 0.127: R12.2 29.21,34.55 | 29.21,34.55 29.21,34.67 | 29.21,34.67 29.21,34.73 | 29.21,34.73 29.21,34.8 | 29.21,34.8 C1.1 | 29.21,34.73 29.34,34.73 | 29.34,34.73 30.23,34.73 30.42,34.92 30.42,35.43 30.61,35.62 31.62,35.62 31.83,35.42 D14.+ | U4.40 29.1,34.69 | 29.1,34.69 29.19,34.69 29.21,34.67 | 29.1,34.69 29.21,34.8 | 29.21,34.55 29.08,34.67 | 29.21,34.8 29.27,34.73 | 29.34,34.73 29.21,34.61
N$13
  Bottom 0.305: R28.1 C27.2 | L1.2 C27.2 | C27.2 ANT4.D
N$15
  Bottom 0.305: C36.2 R29.2 34.74,50.87 ANT1.D
N$21  (via drill 0.2 pad 0.41)
  Top 0.305: U3.4 30.62,15.89 v30.73,16 | R41.2 32.76,14.1 32.77,14.1 v32.89,14.1 32.89,13.72 33.28,13.33 R40.1
  Bottom 0.305: v32.89,14.1 32.64,14.1 v30.73,16
N$22
  Bottom 0.305: SPK.2 45.09,16.64 44.25,17.47 D21.1 42.61,17.47 C53.2 42.16,16.64 41.53,16 39.37,16 38.99,16.38 R70.2
N$23
  Bottom 0.127: R23.1 37.21,38.86 Q1.3
N$24  (via drill 0.2 pad 0.41)
  Top 0.127: v43.18,37.47 42.93,37.21 42.93,12.7 38.61,8.38 v38.61,6.1 | D5.- 7.37,2.67 v7.87,3.18
  Bottom 0.127: R23.2 38.23,37.72 38.48,37.47 v43.18,37.47 | v7.87,3.18 8.13,3.43 19.3,3.43 20.07,2.67 22.61,2.67 25.4,5.46 37.97,5.46 v38.61,6.1
N$26
  Top 0.254: U5.4 19.29,19.29 19.3,19.28 19.3,19.11 | U5.3 19.17,18.79 19.3,18.92 19.3,19.11 | 19.3,19.11 19.18,19.24
  pour Top (isolate 0.254, no thermals): 19.94,22.61 18.8,22.61 18.54,22.35 18.54,19.3 18.67,19.18 19.38,19.18 19.56,19.36 19.56,20.57 20.07,21.08 20.07,22.48
N$27  (via drill 0.2 pad 0.41)
  Top 0.127: R45.1 34.92,16.51 34.29,17.14 33.78,17.14 33.15,17.78 Q5.1 33.15,18.67 33.4,18.92 34.67,18.92 35.18,19.43 v35.18,19.81
  Top 0.152: R45.1 35.05,16.26
  Bottom 0.127: v35.18,19.81 36.58,21.21 36.58,22.61 37.4,23.43 Q3.3
N$28  (via drill 0.2 pad 0.41)
  Top 0.254: U5.16 17.89,16.5 17.65,16.26 17.14,16.26 | U5.14 16.89,16.01
  other vias: 17.4,10.67 16.89,10.67 41.4,3.68 16.89,11.18 17.4,11.18 41.91,3.68 41.91,3.18 41.4,3.18
  pour Top (isolate 0.254, no thermals): 17.53,16.38 16.76,16.38 16.64,16.26 16.64,10.59 16.82,10.41 17.47,10.41 17.65,10.59 17.65,16.26
  pour Top (isolate 0.254, no thermals): 42.16,2.79 42.16,3.76 41.98,3.94 39.75,3.94 39.62,3.81 39.62,2.79 39.75,2.67 42.04,2.67
  pour PWR (isolate 0.254, no thermals): 31.88,9.65 16.69,9.65 16.51,9.83 16.51,11.25 16.69,11.43 32.38,11.43 39.88,3.94 42.04,3.94 42.16,3.81 42.16,2.79 42.04,2.67 38.86,2.67
N$29
  Top 0.305: U3.2 29.34,15.5 | 29.34,15.5 29.34,15.24 29.08,14.99 | 29.34,15.5 28.96,15.11
  pour Top (isolate 0.254, no thermals): 29.46,14.86 29.46,15.24 28.35,15.24 27.81,14.7 27.81,12.95 28.07,12.7 28.83,12.7 29.08,12.95 29.08,14.48
N$30  (via drill 0.2 pad 0.41)
  Top 0.127: R17.1 v14.23,22.23 v14.22,22.22 | D16.- 5.84,2.25 5.84,22.99 v6.1,23.24
  Bottom 0.127: v14.22,22.22 v14.23,22.23 13.21,23.24 12.95,23.5 6.35,23.5 v6.1,23.24
N$31
  Top 0.152: U5.9 15.12,19.29 14.86,19.56 R17.2
N$32
  Bottom 0.305: SPK.1 45.09,19.43 44,18.35 D7.1 42.61,18.35 C54.2 42.16,19.05 41.91,19.3 41.78,19.43 41.27,19.94 R71.2
N$33
  Top 0.254: U5.7 R18.1 R16.2
N$34
  Top 0.152: R20.1 14.22,17.65 14.86,18.29 U5.11
N$36
  Top 0.152: R19.1 15,17.79 U5.12
N$37
  Top 0.254: U5.5 17.89,21.45 R15.1
N$38
  Bottom 0.305: R30.2 C51.2 38.86,17.78 | 38.86,17.78 C48.1 39.63,17.78 C53.1 | R70.1 38.93,17.72 38.86,17.78
N$39
  Bottom 0.305: R31.2 C52.2 C48.2 | C48.2 40.13,18.54 C54.1 | C48.2 R71.1
N$40
  Bottom 0.305: R32.2 D6.1 21.77,4.76 L5.2
N$41
  Bottom 0.305: R35.1 24.26,7.11 27.94,10.79 27.94,17.14 30.35,19.56 30.35,24.38 C62.2 | C67.2 R68.2
  Bottom 0.406: C67.2 C62.2
N$42  (via drill 0.2 pad 0.41)
  Top 0.127: R11.1 29.9,8.44 D9.1 29.72,7.37 29.59,7.24 29.59,6.35 v29.84,6.1 J9.3
  Bottom 0.127: v29.84,6.1 29.84,6.35 TP4.T
N$43  (via drill 0.2 pad 0.41)
  Top 0.305: J1.6 16.5,3.42 v17.14,4.06
  Bottom 0.305: R38.2 18.09,4.63 D10.1 v17.14,4.06
N$44  (via drill 0.2 pad 0.41)
  Top 0.127: R5.1 v30.48,38.1
  PWR 0.127: v30.48,38.1 44.7,38.1 v45.21,37.59
  Bottom 0.127: J10.3 45.97,36.58 45.21,37.34 v45.21,37.59
N$45  (via drill 0.2 pad 0.41)
  Top 0.127: R6.1 v30.48,39.12
  PWR 0.127: v45.72,34.54 45.72,37.72 44.32,39.12 v30.48,39.12
  Bottom 0.127: J10.4 45.75,34.58 v45.72,34.54
N$46
  Top 0.254: U4.2 26.38,40.93 C45.2 26.29,41.65 25.86,42.09 X1.2
N$47  (via drill 0.2 pad 0.41)
  Top 0.127: J1.2 20.46,5.32 19.68,6.1 v19.68,6.35
  Bottom 0.127: R39.2 v19.68,6.35
N$48  (via drill 0.2 pad 0.41)
  Top 0.406: J9.1 28.54,4.86 | 28.54,4.86 28.54,5.49 27.81,6.22 | 28.54,4.86 27.94,5.46
  Bottom 0.406: v25.15,6.35 26.03,6.35 TP1.T
  pour Top (isolate 0.254, no thermals): 24.38,8 26.29,8 28.7,5.59 28.7,5.33 28.57,5.21 25.65,5.21 24.26,6.6 24.26,7.87
N$49
  Bottom 0.305: L5.1 20.57,5.71 20.32,5.97 C69.2 C66.2 R35.2
N$50
  Bottom 0.305: L12.1 20.95,14.61 C37.2 C74.2 C61.2 C58.2 25.4,14.6 25.48,14.69 25.53,14.73 25.65,14.86 25.65,15.49 C65.2 24.13,16.76 23.24,17.65 23.24,20.32 23.62,20.7 R69.2
N$51
  Bottom 0.305: C65.1 24.96,19.11 R37.2 R69.1
N$52
  Bottom 0.305: C64.1 25.84,19.11 R36.2 R7.1
N$53
  Bottom 0.305: L11.1 21.08,13.84 C37.1 C73.1 C59.1 C60.2 25.4,13.84 26.16,14.61 26.16,16.51 C64.2 26.67,16.76 27.56,17.65 27.56,20.45 27.3,20.7 R7.2
N$54
  Bottom 0.127: 39.75,22.1 39.75,23.75 39.12,24.38 38.48,24.38 37.85,25.02 R42.1 | 39.75,22.1 39.75,21.97 | 39.75,21.97 39.75,21.78 Q3.1 | 39.97,21.94 C85.1 R60.2 | 39.91,21.94 39.78,21.94 39.75,21.97 | 39.97,21.94 39.75,21.72 | 39.97,21.94 39.91,21.94 | 39.91,21.94 39.75,22.1
N$55  (via drill 0.2 pad 0.41)
  Top 0.127: D3.- 28.96,42.29 28.32,41.66 28.32,40.13 v28.57,39.88 | R43.2 30.23,33.15 31.62,33.15 32.38,33.91 32.38,35.43 31.24,36.58 v30.99,36.58
  PWR 0.127: v30.99,36.58 30.99,36.83 28.57,39.24 v28.57,39.88
N$56
  Top 0.127: R44.2 29.97,40.17 D17.-
N$60  (via drill 0.2 pad 0.41)
  Top 0.127: R56.2 v15.75,13.97
  Bottom 0.127: J11.P2 5.96,9.14 6.22,9.4 12.83,9.4 13.21,9.78 13.21,13.46 13.99,14.24 J11.P2B 15.48,14.24 v15.75,13.97
N$61  (via drill 0.2 pad 0.41)
  Top 0.127: v10.92,7.87 13.21,10.16 14.1,10.16 14.16,10.22 v14.16,10.29 14.22,10.35 R57.2
  Bottom 0.127: J11.P3B 14.52,10.64 v14.16,10.29 | J11.P3 7.01,7.77 7.37,8.13 10.67,8.13 v10.92,7.87
N$63  (via drill 0.2 pad 0.41)
  Top 0.127: v6.54,18.92 6.6,18.86 6.6,8.95 v6.54,8.89
  Bottom 0.127: J11.P6B 14.18,13.04 13.46,12.32 13.46,9.65 12.7,8.89 v6.54,8.89 | J11.P6 5.96,19.18 6.22,18.92 v6.54,18.92
N$64  (via drill 0.2 pad 0.41)
  Top 0.127: v15.62,11.81 14.48,11.81 R58.2 | v6.6,8 6.98,8.38 6.98,20.57 v6.6,20.96
  Bottom 0.127: v15.62,11.81 15.59,11.84 J11.P7B 14.13,11.84 13.72,11.43 13.72,9.4 12.7,8.38 6.98,8.38 v6.6,8 | J11.P7 7.01,20.55 v6.6,20.96
NETLIGHT
  Bottom 0.127: U1.47 34.9,37.69 Q1.1 35.56,37.34 R50.2
PA27_TX_LED
  Top 0.127: R43.1 28.96,33.4 28.17,34.19 U4.39
PA30_SWCLK/TX
  Top 0.127: URAT.2 36.58,28.69 36.32,28.94 36.32,30.48 35.81,30.99 35.18,30.99 34.16,32 34.16,36.83 33.4,37.59 29.34,37.59 | U4.45 28.05,37.19 28.45,37.59 29.08,37.59 | 29.08,37.59 29.21,37.59 | 29.21,37.59 29.34,37.59 | R5.2 29.21,37.85 29.21,37.72 | 29.21,37.72 29.21,37.59 | 29.21,37.72 | 29.21,37.72 29.08,37.59 | 29.21,37.72 29.34,37.59
PA31_SWDIO/RX
  Top 0.127: URAT.1 36.5,30.69 35.94,31.24 35.31,31.24 34.42,32.13 34.42,37.34 33.15,38.61 29.34,38.61 | 29.08,38.61 28.96,38.61 28.04,37.69 U4.46 | 29.08,38.61 29.21,38.61 | 29.21,38.61 29.34,38.61 | R6.2 29.21,38.88 29.21,38.74 | 29.21,38.73 29.21,38.61 | 29.21,38.74 29.21,38.73 | 29.21,38.73 29.08,38.61 | 29.21,38.74 29.34,38.61
PB03_RX_LED
  Top 0.127: U4.48 28.02,38.69 29.21,39.88 | 29.21,39.88 | R44.1 29.21,39.88
PB22_TXD
  Top 0.127: R53.1 28.96,32 27.77,33.19 U4.37
PB23_RXD
  Top 0.127: R27.2 28.03,33.69 U4.38
PWRKEY  (via drill 0.2 pad 0.41)
  Top 0.127: K1.4 8.97,3.1 6.1,5.97 6.1,21.08 6.98,21.97 6.98,22.99 v6.1,23.88 | v18.16,25.53 18.16,29.21 R9.1 20.45,30.1 20.83,29.72 Q2.3
  Bottom 0.127: 26.16,25.53 v18.16,25.53 7.24,25.53 6.1,24.38 v6.1,23.88
  Bottom 0.305: U1.5 27.13,25.99 TP5.T 26.92,25.91 26.54,25.53 26.16,25.53
RF_ANT/GSM
  Bottom 0.305: R29.1 C35.2 33.4,49.26 arc-45 32.78,47.77 30.55,45.53 arc45 30.13,44.53 U1.41
RXD  (via drill 0.2 pad 0.41)
  Top 0.127: R51.2 v18.29,38.86 R52.2
  PWR 0.127: v18.29,38.86 18.29,39.12 21.27,42.1 v22.35,42.1
  Bottom 0.127: TP13.T 22.13,44.99 U1.33 22.13,42.32 v22.35,42.1
RXD_AUX  (via drill 0.2 pad 0.41)
  Top 0.127: v16.51,38.61 13.84,38.61 v12.95,37.72
  Bottom 0.127: R48.1 v12.95,37.72 | U1.24 16.42,38.69 v16.51,38.61
SCL  (via drill 0.2 pad 0.41)
  Top 0.127: U4.32 24.88,31.36 v24.77,31.24 R13.1 | I2C.1 36.27,44.66 35.69,44.07 35.69,32.13 v36.32,31.5
  PWR 0.127: v24.77,31.24 36.07,31.24 v36.32,31.5
SD_CLK  (via drill 0.2 pad 0.41)
  Top 0.127: v3.17,24.38 3.17,28.57 v2.79,28.96
  Bottom 0.127: U1.8 24.13,27.56 23.24,26.67 7.24,26.67 4.95,24.38 v3.17,24.38 | R64.2 v2.79,28.96
SD_CMD  (via drill 0.2 pad 0.41)
  Top 0.127: v2.79,31.5 2.79,31.37 3.68,30.48 3.68,24.13 3.43,23.88 v2.92,23.88
  Bottom 0.127: U1.7 25.13,27.54 24,26.42 7.37,26.42 4.83,23.88 v2.92,23.88 | R62.2 v2.79,31.5
SD_DATA
  Bottom 0.127: U1.9 23.13,27.57 22.48,26.92 3.3,26.92 3.17,26.79 R66.2
SDA  (via drill 0.2 pad 0.41)
  Top 0.127: U4.31 24.38,31.49 v24.13,31.24 R14.1 | I2C.2 36.31,42.66 35.94,42.29 35.94,32.64 v36.96,31.62
  PWR 0.127: v24.13,31.24 24.64,31.75 25.15,31.75 25.4,31.5 35.56,31.5 36.2,32.13 36.7,32.13 36.96,31.88 v36.96,31.62
SIM1_CLK  (via drill 0.2 pad 0.41)
  Top 0.127: R57.1 C5.2 12.89,11.43 v12.76,11.3
  PWR 0.127: v16.89,32.64 16.89,32.39 14.73,30.23 10.92,30.23 9.91,29.21 9.91,14.1 12.7,11.3 v12.76,11.3
  Bottom 0.127: U1.19 16.22,33.69 16.51,33.4 16.51,33.02 v16.89,32.64
SIM1_DATA  (via drill 0.2 pad 0.41)
  Top 0.127: R58.1 C6.2 13.02,12.83 v12.76,12.57
  PWR 0.127: v17.02,33.27 17.4,33.27 17.91,32.77 17.91,31.37 16.13,29.59 11.94,29.59 10.54,28.19 10.54,14.86 12.76,12.64 v12.76,12.57
  Bottom 0.127: U1.21 16.38,35.69 17.14,34.92 17.14,33.4 v17.02,33.27
SIM1_RST  (via drill 0.2 pad 0.41)
  Top 0.127: C13.2 13.97,13.59 v13.72,13.34 | R56.1 C13.2 | C13.2
  PWR 0.127: v13.72,13.34 13.59,13.21 12.57,13.21 10.8,14.99 10.8,28.07 12.06,29.34 16.26,29.34 18.16,31.24 18.16,32.89 17.14,33.91 v16.64,33.91
  Bottom 0.127: U1.20 16.36,34.69 16.64,34.42 v16.64,33.91
SIM1_VDD  (via drill 0.2 pad 0.41, 0.25 pad 0.51)
  Top 0.508: v5.33,32.77 v5.33,21.84 v5.33,18.29 5.33,8.38 v4.95,8
  PWR 0.508: v13.97,32.77 v5.33,32.77
  Bottom 0.406: J11.P1 4.91,7.96 v4.95,8 | C86.2 v5.34,21.84 v5.33,21.84 C11.2
  Bottom 0.508: J11.P1B 14.82,17.06 13.59,18.29 v5.33,18.29 | U1.18 14.04,32.69 v13.97,32.77
SIM_GND  (via drill 0.2 pad 0.41)
  PWR 0.508: v4.57,20.76 4.57,28.45 7.75,31.62 v13.84,31.62
  Bottom 0.406: C11.1 4.32,22.61 4.06,22.35 4.06,21.34 4.57,20.83 v4.57,20.76
  Bottom 0.508: J11.P5B 14.02,15.44 13.59,15.88 13.59,16.89 12.95,17.53 4.95,17.53 4.57,17.91 4.57,19.56 4.95,19.94 J11.P5 | J11.P5 | J11.P5 4.92,20.42 v4.57,20.76 | U1.16 14.26,30.69 13.84,31.11 v13.84,31.62
SPI_MISO  (via drill 0.2 pad 0.41)
  Top 0.127: U4.21 8.02,34.69 v7.37,34.04
  PWR 0.127: v1.78,25.15 2.03,25.4 2.03,32 4.06,34.04 v7.37,34.04
  Bottom 0.127: R67.2 v1.78,25.15
  Bottom 0.406: TP16.T v1.78,25.15
SPI_MOSI  (via drill 0.2 pad 0.41)
  Top 0.127: U4.19 19.94,35.69 19.49,35.24 7.43,35.24 v7.37,35.31
  PWR 0.127: v1.27,30.99 1.52,31.24 1.52,32.26 4.57,35.31 v7.37,35.31
  Bottom 0.406: v1.27,30.99 1.02,30.73 TP14.T R63.2
SPI_SCK  (via drill 0.2 pad 0.41)
  Top 0.127: U4.20 19.95,35.19 19.75,34.99 7.68,34.99 v7.37,34.67
  PWR 0.127: v1.52,28.38 1.52,28.45 1.78,28.7 1.78,32.13 4.32,34.67 v7.37,34.67
  Bottom 0.406: v1.52,28.38 1.02,27.88 TP15.T R65.2
SPKN  (via drill 0.2 pad 0.41, 0.25 pad 0.51)
  PWR 0.305: v24.96,21.15 25.15,21.34 25.15,23.24 28.38,26.48 28.38,27.11 v28.32,27.18
  Bottom 0.305: U1.4 28.13,27.37 v28.32,27.18 | R37.1 v24.96,21.15
SPKP  (via drill 0.2 pad 0.41, 0.25 pad 0.51)
  PWR 0.305: v25.78,21.15 25.78,21.21 25.65,21.34 25.65,22.99 28.7,26.04 28.83,26.16 28.89,26.23 28.89,27.11 v28.96,27.18
  Bottom 0.305: U1.3 29.13,27.35 v28.96,27.18 | R36.1 25.84,21.08 v25.78,21.15
TXD  (via drill 0.2 pad 0.41)
  Top 0.127: R8.1 17.4,36.07 17.02,36.45 v17.02,37.59
  PWR 0.127: v17.02,37.59 17.02,38.23 21.34,42.55 v22.86,42.55
  Bottom 0.127: TP11.T 24.26,45.21 23.49,45.21 23.13,44.85 U1.34 23.13,42.81 v22.86,42.55
TXD_AUX
  Bottom 0.127: U1.25 13.4,39.69 R49.1
USB_D+
  Top 0.127: U4.34 25.88,31.98 25.78,31.88 25.78,29.46 27.69,27.56 27.69,22.86 26.67,21.84 26.67,12.45 29.84,9.27 R11.2
USB_D-
  Top 0.127: R21.2 28.96,9.78 26.42,12.32 26.42,21.97 27.43,22.99 27.43,27.43 25.53,29.34 25.53,31.88 25.38,32.02 U4.33
VBAT
  Bottom 0.635: U1.50 34.14,34.69 34.54,34.29 | U1.51 34.2,33.69 34.67,34.16
  pour Bottom (isolate 0.254, no thermals): 44.32,27.05 41.15,27.05 40.77,27.43 40.77,31.5 40.13,32.13 37.34,32.13 36.58,32.89 34.67,32.89 34.16,33.4 34.16,34.67 34.29,34.8 36.58,34.8 37.08,34.29 43.43,34.29 44.45,33.27 44.45,27.18
VDDCORE
  Top 0.305: U4.43 29.09,36.19 C2.1
VSYS  (via drill 0.2 pad 0.41)
  Top 0.254: U5.1 17.66,17.79 17.39,17.52 U5.15 | D16.+ 6.4,1.19 6.6,1.4 v6.6,4.83
  Top 0.305: U3.8 28.84,18.91 28.83,18.92 | U3.7 29.34,18.29 | 29.34,18.29 29.34,18.54 | 29.34,18.54 29.08,18.8 | U3.5 30.34,18.3 30.1,18.54 29.59,18.54 | 29.59,18.54 29.34,18.54 | 29.34,18.29 29.59,18.54
  Top 0.406: R61.2 34.38,29.88 35.56,28.7 35.56,24 | 35.56,24 35.56,23.24 | 35.56,24 34.92,23.37 | 35.56,24 36.07,23.5 | v27.94,21.08 v28.45,20.57
  PWR 0.254: v6.6,4.83 6.6,7.24 7.11,7.75 7.11,24.57 v6.98,24.7
  Bottom 0.254: 21.07,20.84 18.03,23.88 7.81,23.88 v6.98,24.7 | 21.07,20.84 v21.46,20.45 | 21.07,20.84 21.07,20.25 21.01,20.19 | 21.07,20.84 21.88,20.84 21.89,20.83
  Bottom 0.508: 21.59,20.57 v21.46,20.45
  other vias: 22.1,20.45 18.67,17.27 19.18,17.27 28.45,21.08 41.15,24.89 41.66,24.89 22.1,20.96 41.4,24.51
  pour Top (isolate 0.254, no thermals): 20.83,22.61 22.61,22.61 22.86,22.35 22.86,20.83 22.22,20.19 21.08,20.19 20.83,19.94 20.83,19.3 20.7,19.18 20.07,19.18 19.94,19.3 19.94,20.45 20.7,21.21 20.7,22.48
  pour Top (isolate 0.254, no thermals): 18.41,17.91 18.83,17.91 19.43,17.31 19.43,17.02 19.3,16.89 18.41,16.89 18.29,17.02 18.29,17.78
  pour Bottom (isolate 0.254, no thermals): 21.34,20.83 22.22,20.83 22.48,20.57 22.48,20.07 19.3,16.89 18.41,16.89 18.29,17.02 18.29,17.78
  pour Top (isolate 0.254, no thermals): 28.07,18.54 29.21,18.54 29.34,18.67 29.34,21.72 29.21,21.84 28.07,21.84 27.94,21.72 27.94,18.67
  pour Bottom (isolate 0.254, rank 2, no thermals): 28.7,20.19 28.43,20.19 27.69,20.93 27.69,21.59 27.3,21.97 24.38,21.97 22.48,20.07 21.34,20.07 21.21,20.19 21.21,20.7 23.75,23.24 27.94,23.24 28.96,22.22 28.96,20.45
  pour Top (isolate 0.254, rank 2, no thermals): 27.94,21.46 27.94,21.72 29.08,22.86 32,22.86 32.89,23.75 39.24,23.75 41.02,25.53 41.66,25.53 41.91,25.27 41.91,24.76 39.62,22.48 33.27,22.48 32.64,21.84 29.46,21.84 29.34,21.72 29.34,21.46 29.21,21.34 28.07,21.34
  pour Bottom (isolate 0.254, no thermals): 42.93,24.38 41.05,24.38 40.77,24.67 40.77,25.07 41.22,25.53 41.66,25.53 42.42,26.29 43.43,26.29 43.56,26.16 43.56,25.02

## Text on the board
tNames: SCL | GND | SDA | 3V3 | TX | 3V3 | D2 | RX | I2C | D3 | GND | D2 | RST | GND | RX | 3V3 | 3V3 | TX | D4 | D5 | UART | GND | D4 | A0 | GND | A1 | 3V3 | 3V3 | A2 | A0 | A3 | GND | A2 | PWR | RESET | NET | - | BAT | +
bNames: 3V3 | GND | DIO | CLK | RST | MOSI | SCK | MISO | + | - | GPS Tracker | v1.2 04/11/2017